# Altium schematic sheet 02_Power.SchDoc
size A4; SheetNumber: 2; SheetTotal: 4
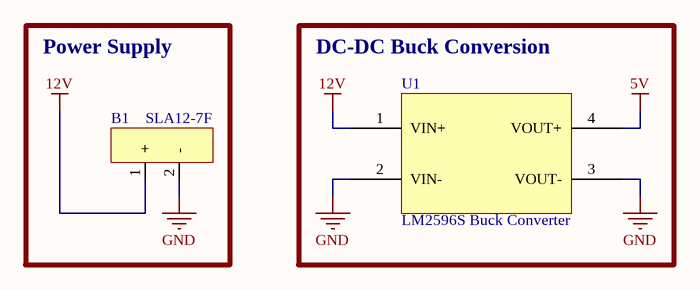
[diagram p0: 02_Power.SchDoc]

## Parts
B1  SLA12-7F  [SLA12-7F]
U1  LM2596S Buck Converter  [LM2596S Buck Converter]

## Blocks framed on the sheet
Power Supply: B1
DC-DC Buck Conversion: U1

## Nets
5V: U1.4(VOUT+)
12V: B1.1(+) U1.1(VIN+)
GND: B1.2(-) U1.2(VIN-) U1.3(VOUT-)

## Library data of the parts
B1 = SLA12-7F: AJC Brand Replacement for a Duracell Ultra SLA12-7F 12V 7Ah Sealed Lead Acid Battery / Voltage: 12V (12 Volts) / Capacity: 7Ah / Terminals: F1 5.94 x 2.56 x 3.7 inches; Manufacturer Part Number: AJC-D7S; Supplier: Amazon; Manufacturer: AJC; RoHS: Unavailable; Category: Battery; Stock: 1; Pricing: 26.99; Votlage Rating: 12V; Energy Rating: 7Ah; Length: 5.94in; Width: 2.56in; Height: 3.7; Supplier Part Number: B0BL1MQMK3
U1 = LM2596S Buck Converter: Product parameters: input voltage is 4.0V - 40V, output voltage is 1.25V - 37V, output current is 2A (normal and stable) and 3A max, conversion efficiency 92% (highest), output ripple under 30mV, switching frequency 150KHz, operating temperature is -45 to 85 degree Celsius / Simple to operate: the voltmeter can be turned off, and the switch can be turned off by pressing and holding the switch for more than 1 second and less than 4 seconds, once the voltmeter is turned off, simply press the switch to turn on the voltmeter / Easy to use: with terminal block, no soldering iron is also convenient to use, and retain the wire bond point (the input voltage must be higher than the voltage to be output by 1v or more) / Output current: the maximum output current can be as high as 3A, the recommended working current is about 2A, more than 2A plus heat sink / Nice design: with 150KHz internal oscillation frequency, features low power consumption and high efficiency; When the output voltage cannot be adjusted and is always equal to the input voltage, please turn the potentiometer counterclockwise for more than 10 turns, and then use the module to adjust the voltage normally; This is because when the module leaves the factory, the default output voltage is about 20V; Manufacturer: Frienda; Manufacturer Part Number: Frienda-Power Converters-01; Input Voltage: 4.0-40.0V; Output Voltage: 1.25-37.0V; Supplier: Amazon; RoHS: Unavailable; Category: DC-DC Buck Conversion; Stock: 4; Pricing: 13.99; Output Current: 2A; Max Output Current: 3A; Frequency: 150kHz; Length: 7.05in; Width: 4.72in; Height: 0.83in; Operating Temperature: -40-+85 deg C; Supplier Part Number: B081N6WWJS